# Altium schematic sheet CarWire.SchDoc
size 800 x 800 mm; SheetNumber: 1; SheetTotal: 2
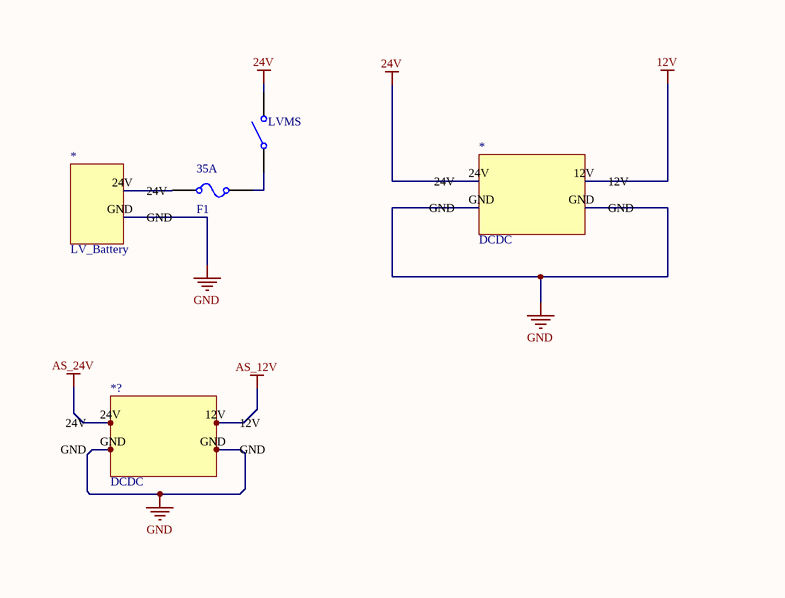
[diagram p0: CarWire.SchDoc, top left]
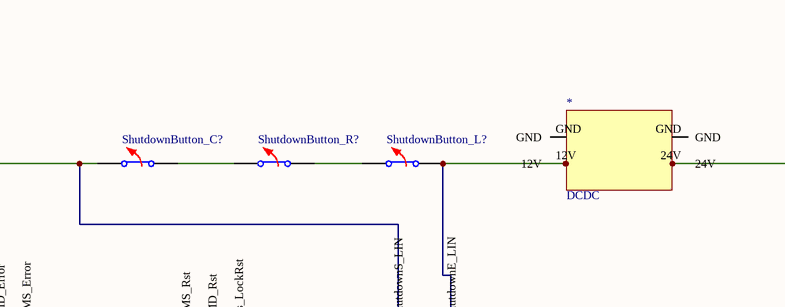
[diagram p1: CarWire.SchDoc, top right]
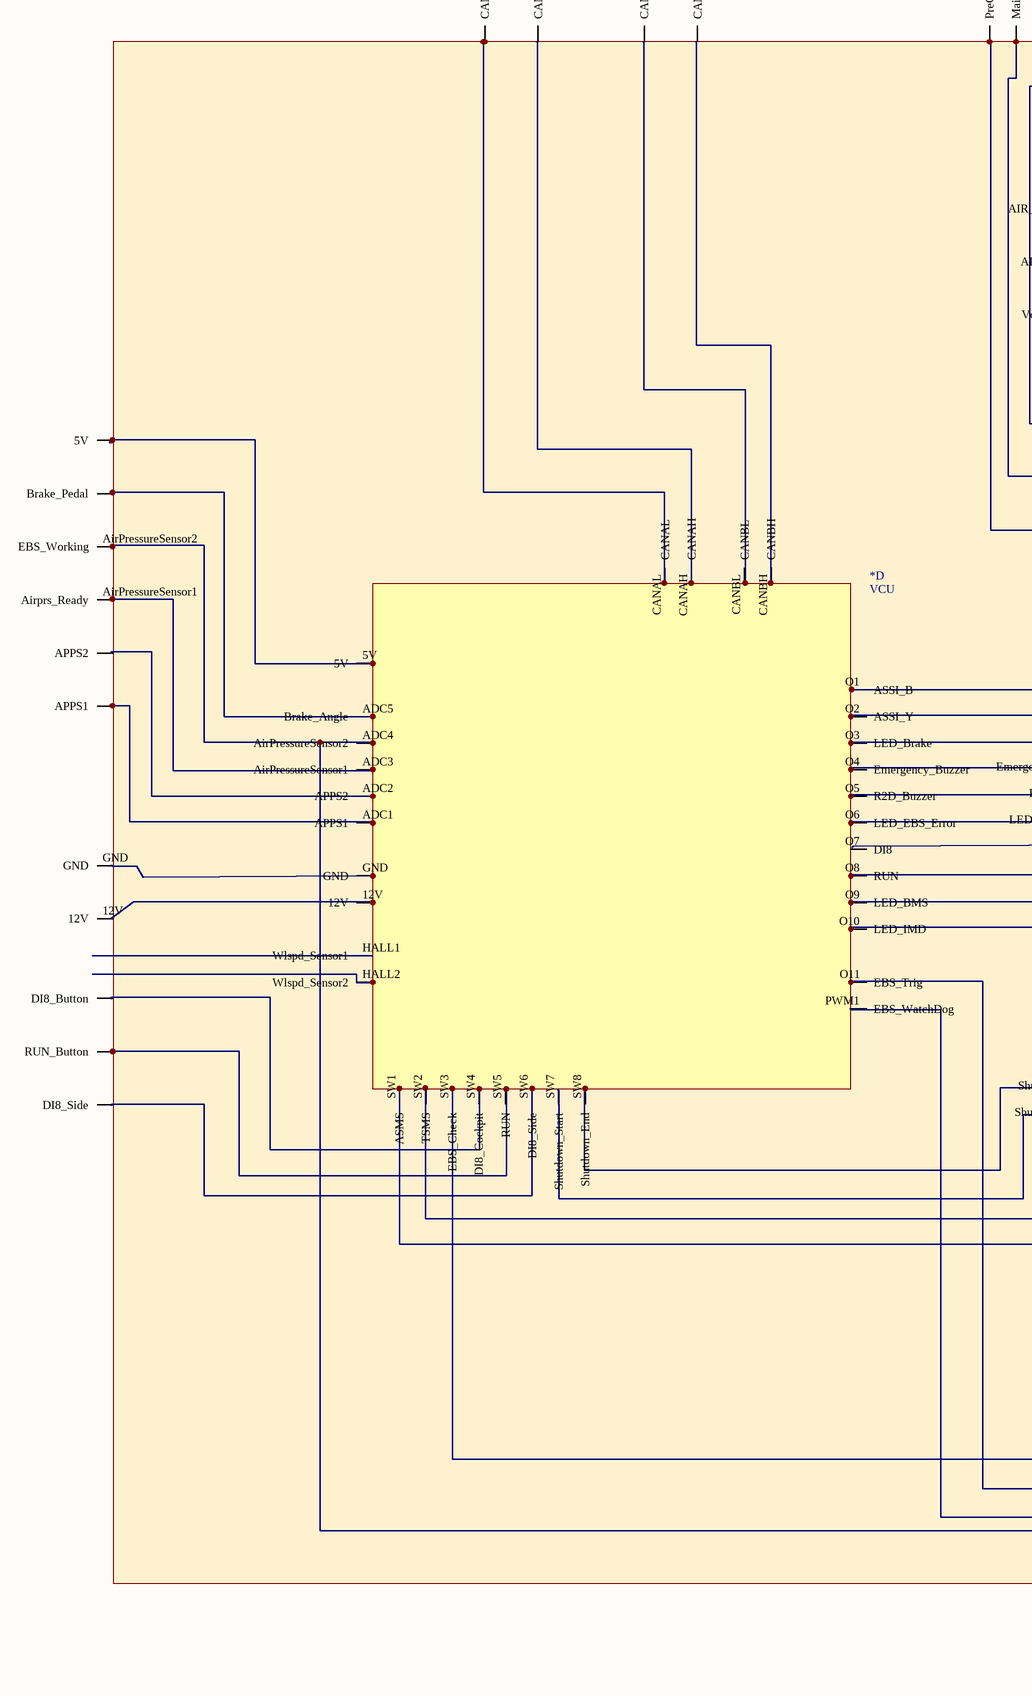
[diagram p2: CarWire.SchDoc, bottom left]
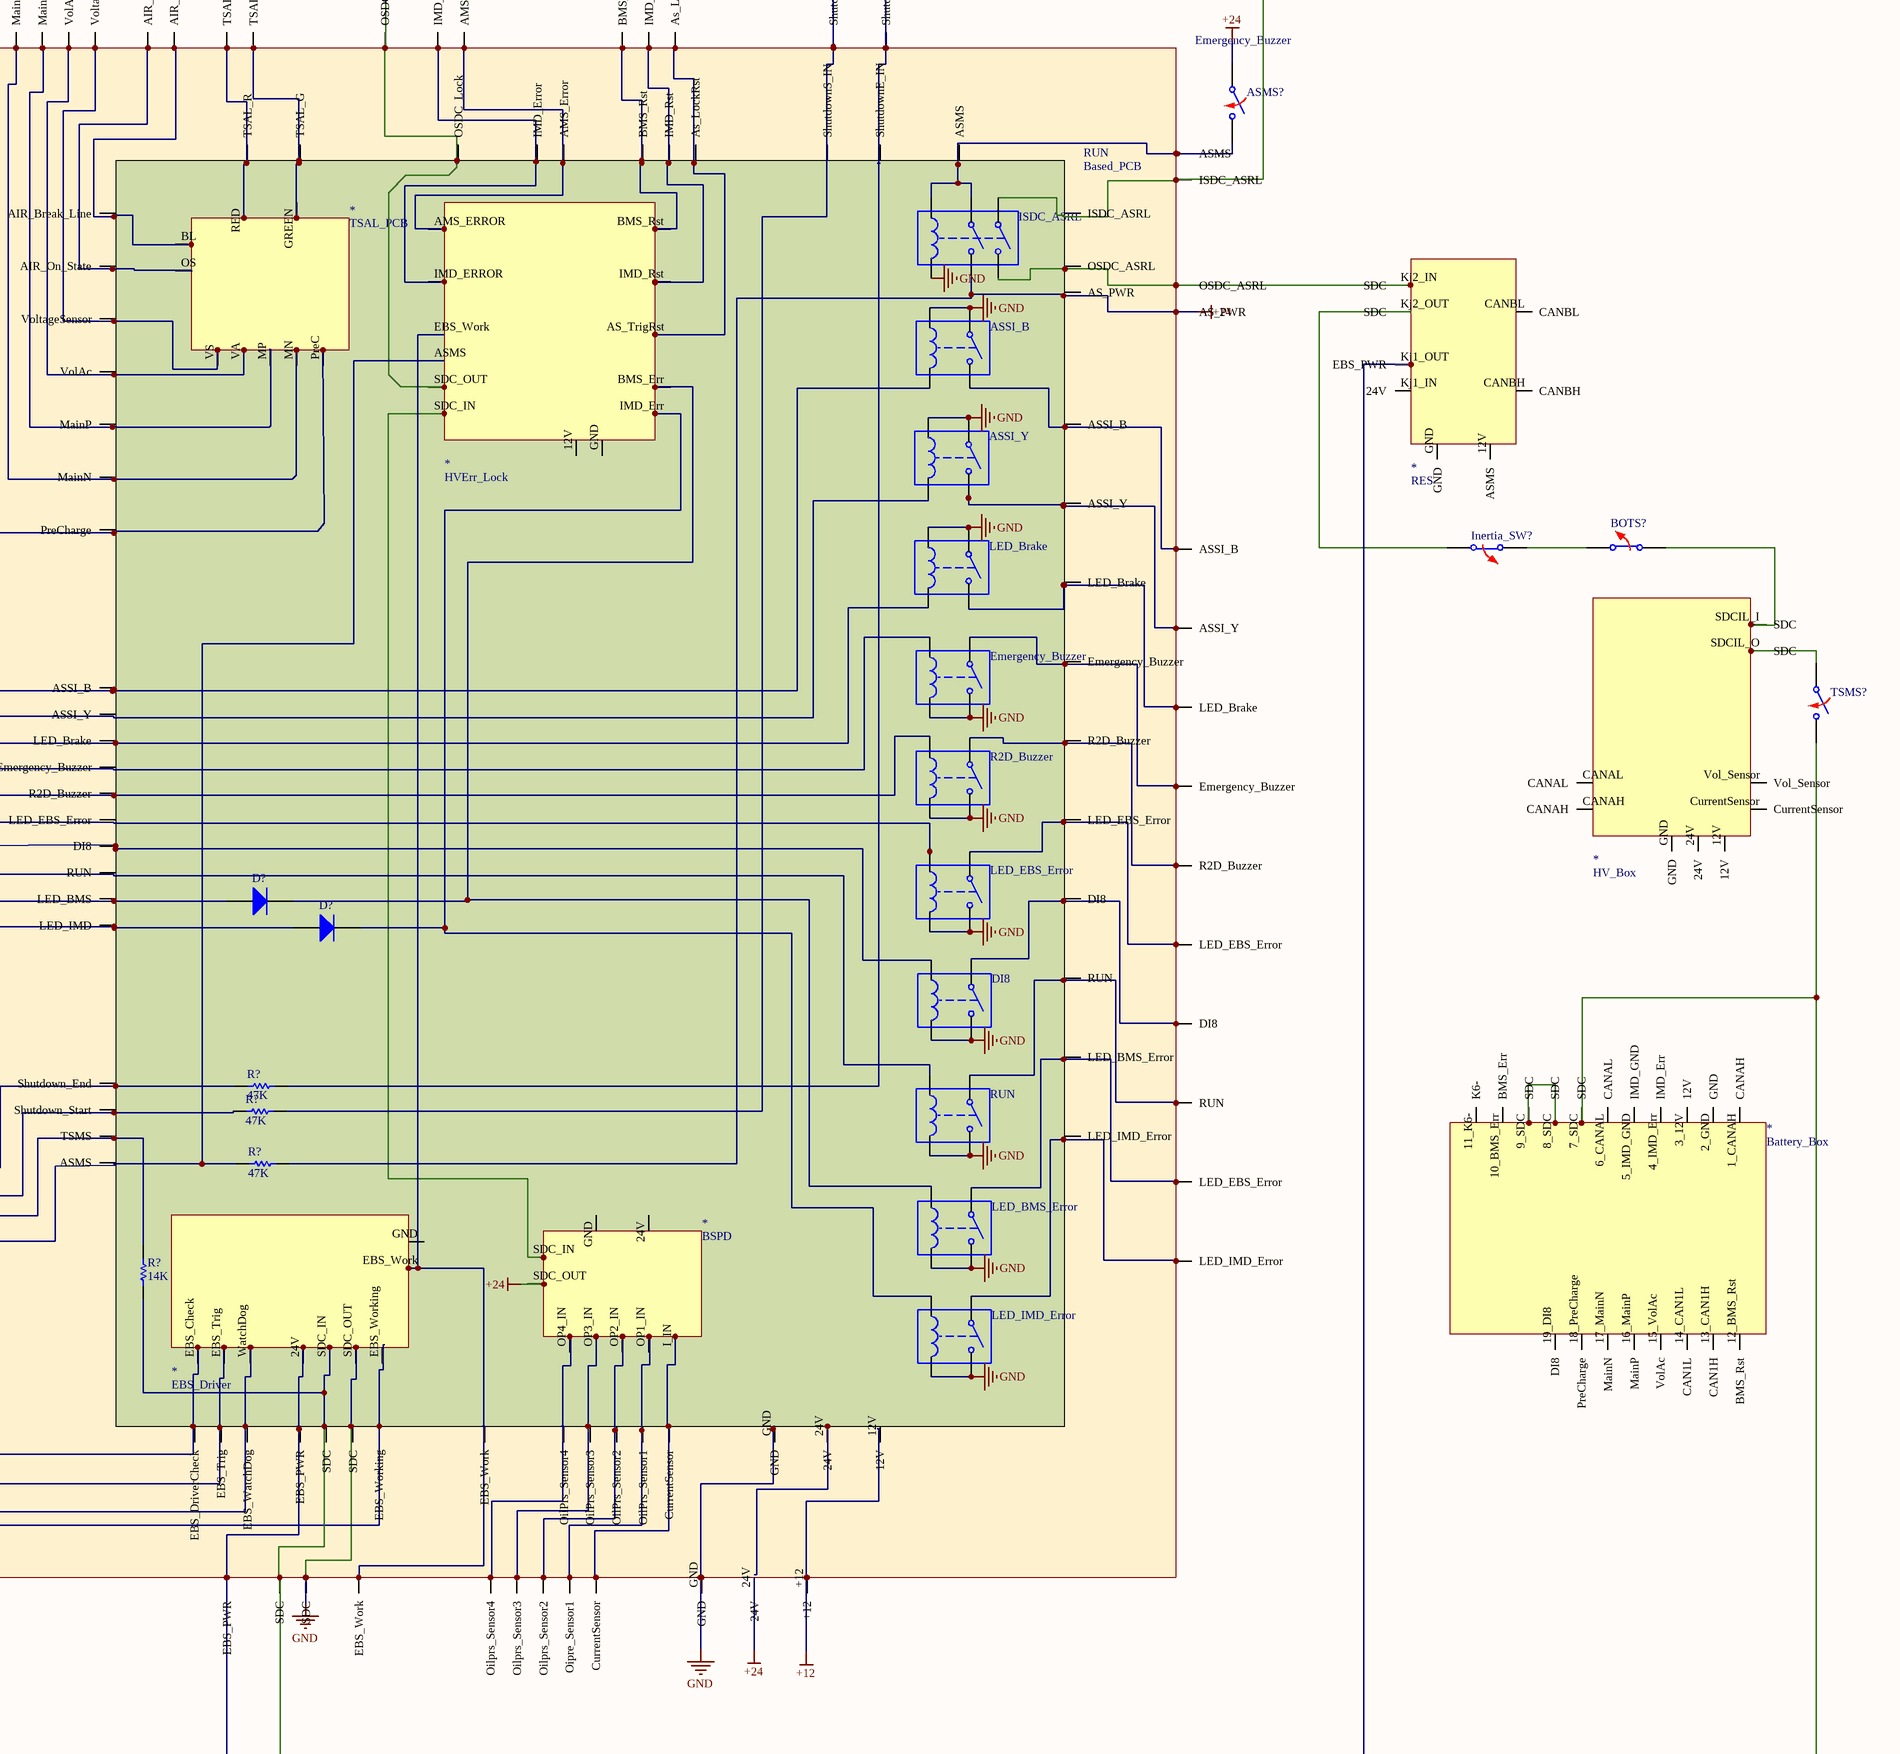
[diagram p3: CarWire.SchDoc, bottom right]

## Parts
(Parts that share a designator on the sheet are numbered #1, #2 ... from top to bottom, then left to right.)
35A  F1
*#1  DCDC
*#2  LV_Battery
*#3  DCDC
*#4  RES
*#5  TSAL_PCB
*#6  HVErr_Lock
*#7  HV_Box
*#8  VCU  (part D of 4)
*#9  Battery_Box
*#10  BSPD
*#11  EBS_Driver
*?  DCDC
ASMS?  Switch Normally Opened  (value not drawn)
ASSI_B  Single-Pole, Single-Throw Normally Opened Relay  (value not drawn)
ASSI_Y  Single-Pole, Single-Throw Normally Opened Relay  (value not drawn)
BOTS?  Switch Normally Closed  (value not drawn)
D?#1  Diode  (value not drawn)
D?#2  Diode  (value not drawn)
DI8  Single-Pole, Single-Throw Normally Opened Relay  (value not drawn)
Emergency_Buzzer#1  Single-Pole, Single-Throw Normally Opened Relay  (value not drawn)
Emergency_Buzzer#2  (no value)
Inertia_SW?  Switch Normally Closed  (value not drawn)
ISDC_ASRL  Double-Pole, Single-Throw Relay  (value not drawn)
LED_BMS_Error  Single-Pole, Single-Throw Normally Opened Relay  (value not drawn)
LED_Brake  Single-Pole, Single-Throw Normally Opened Relay  (value not drawn)
LED_EBS_Error  Single-Pole, Single-Throw Normally Opened Relay  (value not drawn)
LED_IMD_Error  Single-Pole, Single-Throw Normally Opened Relay  (value not drawn)
LVMS  Single-Pole, Single-Throw Switch  (value not drawn)
R2D_Buzzer  Single-Pole, Single-Throw Normally Opened Relay  (value not drawn)
R?#1  value 47K  (hidden comment: Resistor)
R?#2  value 47K  (hidden comment: Resistor)
R?#3  value 47K  (hidden comment: Resistor)
R?#4  value 14K  (hidden comment: Resistor)
RUN#1  Single-Pole, Single-Throw Normally Opened Relay  (value not drawn)
RUN#2  Based_PCB
ShutdownButton_C?  Switch Normally Closed  (value not drawn)
ShutdownButton_L?  Switch Normally Closed  (value not drawn)
ShutdownButton_R?  Switch Normally Closed  (value not drawn)
TSMS?  Switch Normally Opened  (value not drawn)

## Nets
12V: *#1.12V
24V: *#1.24V LVMS.2
+12: Emergency_Buzzer#2.+12
+24: *#10.SDC_OUT ASMS?.1 Emergency_Buzzer#2.24V Emergency_Buzzer#2.?27(AS_PWR) ISDC_ASRL.4 R?#3.2
AS_12V: *?.12V
AS_24V: *?.24V
GND: *#1.GND *#2.GND *#11.SDC_OUT *?.GND ASSI_B.1 ASSI_B.3 ASSI_Y.1 ASSI_Y.3 DI8.2 DI8.4 Emergency_Buzzer#1.2 Emergency_Buzzer#1.4 Emergency_Buzzer#2.?37(SDC) Emergency_Buzzer#2.GND ISDC_ASRL.6 LED_BMS_Error.2 LED_BMS_Error.4 LED_Brake.1 LED_Brake.3 LED_EBS_Error.2 LED_EBS_Error.4 LED_IMD_Error.2 LED_IMD_Error.4 R2D_Buzzer.2 R2D_Buzzer.4 RUN#1.2 RUN#1.4 RUN#2.?2(SDC) RUN#2.GND
Net35A_1: 35A.1 *#2.24V
Net35A_2: 35A.2 LVMS.1
Net*#3_12V: *#3.12V Emergency_Buzzer#2.?49(ShutdownE_LIN) R?#1.2 ShutdownButton_L?.2
Net*#3_24V: *#3.24V Emergency_Buzzer#2.?25(ISDC_ASRL) ISDC_ASRL.1
Net*#4_Kj1_OUT: *#4.Kj1_OUT(EBS_PWR) *#11.24V Emergency_Buzzer#2.?36(EBS_PWR)
Net*#4_Kj2_IN: *#4.Kj2_IN(SDC) Emergency_Buzzer#2.?26(OSDC_ASRL) ISDC_ASRL.2
Net*#4_Kj2_OUT: *#4.Kj2_OUT(SDC) Inertia_SW?.2
Net*#5_BL: *#5.BL Emergency_Buzzer#2.?16(AIR_Break_Line)
Net*#5_GREEN: *#5.GREEN Emergency_Buzzer#2.?18(TSAL_G) RUN#2.?27(TSAL_G)
Net*#5_MN: *#5.MN Emergency_Buzzer#2.?11(MainN)
Net*#5_MP: *#5.MP Emergency_Buzzer#2.?12(MainP)
Net*#5_OS: *#5.OS Emergency_Buzzer#2.?15(AIR_On_State)
Net*#5_PreC: *#5.PreC Emergency_Buzzer#2.?10(PreCharge)
Net*#5_RED: *#5.RED Emergency_Buzzer#2.?17(TSAL_R)
Net*#5_VA: *#5.VA Emergency_Buzzer#2.?13(VolAc)
Net*#5_VS: *#5.VS Emergency_Buzzer#2.?14(VoltageSensor)
Net*#6_AMS_ERROR: *#6.AMS_ERROR Emergency_Buzzer#2.?20(AMS_Error)
Net*#6_AS_TrigRst: *#6.AS_TrigRst Emergency_Buzzer#2.?22(As_LockRst)
Net*#6_ASMS: *#6.ASMS *#8.SW1(ASMS) R?#3.1
Net*#6_BMS_Err: *#6.BMS_Err D?#1.2(K) LED_BMS_Error.3
Net*#6_BMS_Rst: *#6.BMS_Rst Emergency_Buzzer#2.?23(BMS_Rst) RUN#2.?32(BMS_Rst)
Net*#6_EBS_Work: *#6.EBS_Work *#11.EBS_Work Emergency_Buzzer#2.?39(EBS_Work)
Net*#6_IMD_Err: *#6.IMD_Err D?#2.2(K) LED_IMD_Error.3
Net*#6_IMD_ERROR: *#6.IMD_ERROR Emergency_Buzzer#2.?21(IMD_Error)
Net*#6_IMD_Rst: *#6.IMD_Rst Emergency_Buzzer#2.?44(IMD_Rst)
Net*#6_SDC_IN: *#6.SDC_IN *#10.SDC_IN
Net*#6_SDC_OUT: *#6.SDC_OUT Emergency_Buzzer#2.?19(OSDC_Lock) Emergency_Buzzer#2.?48(ShutdownS_LIN) R?#2.2 RUN#2.?30(OSDC_Lock) ShutdownButton_C?.1
Net*#7_SDCIL_I: *#7.SDCIL_I(SDC) BOTS?.2
Net*#7_SDCIL_O: *#7.SDCIL_O(SDC) TSMS?.1
Net*#8_ADC1: *#8.ADC1(APPS1) Emergency_Buzzer#2.?3(APPS1)
Net*#8_ADC4: *#8.ADC4(AirPressureSensor2) RUN#2.?6(EBS_Working)
Net*#8_O1: *#8.O1(ASSI_B) ASSI_B.4 RUN#2.?18(ASSI_B)
Net*#8_O2: *#8.O2(ASSI_Y) ASSI_Y.4
Net*#8_O3: *#8.O3(LED_Brake) LED_Brake.4
Net*#8_O4: *#8.O4(Emergency_Buzzer) Emergency_Buzzer#1.3
Net*#8_O5: *#8.O5(R2D_Buzzer) R2D_Buzzer.3
Net*#8_O6: *#8.O6(LED_EBS_Error) LED_EBS_Error.3
Net*#8_O8: *#8.O8(RUN) RUN#1.3
Net*#8_O9: *#8.O9(LED_BMS) D?#1.1(A)
Net*#8_O10: *#8.O10(LED_IMD) D?#2.1(A) RUN#2.?57(LED_IMD)
Net*#8_O11: *#8.O11(EBS_Trig) *#11.EBS_Trig
Net*#8_PWM1: *#8.PWM1(EBS_WatchDog) *#11.WatchDog RUN#2.?5(EBS_WatchDog)
Net*#8_SW2: *#8.SW2(TSMS) R?#4.2
Net*#8_SW3: *#8.SW3(EBS_Check) *#11.EBS_Check RUN#2.?3(EBS_DriverCheck)
Net*#8_SW8: *#8.SW8(Shutdown_End) R?#1.1 RUN#2.?53(Shutdown_End)
Net*#9_7_SDC: *#9.7_SDC(SDC) *#11.SDC_IN Emergency_Buzzer#2.?38(SDC) R?#4.1 RUN#2.?1(SDC) TSMS?.2
Net*#9_8_SDC: *#9.8_SDC(SDC) *#9.9_SDC(SDC)
Net*#10_I_IN: *#10.I_IN Emergency_Buzzer#2.?42(CurrentSensor) RUN#2.?8(CurrentSensor)
Net*#10_OP1_IN: *#10.OP1_IN Emergency_Buzzer#2.?41(Oipre_Sensor1)
Net*#10_OP2_IN: *#10.OP2_IN Emergency_Buzzer#2.?46(Oilprs_Sensor2)
Net*#10_OP3_IN: *#10.OP3_IN Emergency_Buzzer#2.?40(Oilprs_Sensor3) RUN#2.?48(OilPrs_Sensor3)
Net*#10_OP4_IN: *#10.OP4_IN Emergency_Buzzer#2.?47(Oilprs_Sensor4)
NetASMS?_2: ASMS?.2 Emergency_Buzzer#2.?24(ASMS) ISDC_ASRL.3 ISDC_ASRL.5
NetASSI_B_2: ASSI_B.2 Emergency_Buzzer#2.?28(ASSI_B)
NetASSI_Y_2: ASSI_Y.2 Emergency_Buzzer#2.?29(ASSI_Y) RUN#2.?38(ASSI_Y)
NetBOTS?_1: BOTS?.1 Inertia_SW?.1
NetDI8_1: DI8.1 Emergency_Buzzer#2.?34(DI8)
NetDI8_3: DI8.3 RUN#2.?24(DI8)
NetEmergency_Buzzer#1_1: Emergency_Buzzer#1.1 Emergency_Buzzer#2.?31(Emergency_Buzzer)
NetEmergency_Buzzer#2_?30: Emergency_Buzzer#2.?30(LED_Brake) LED_Brake.2 RUN#2.?39(LED_Brake)
NetEmergency_Buzzer#2_?32: Emergency_Buzzer#2.?32(R2D_Buzzer) R2D_Buzzer.1
NetEmergency_Buzzer#2_?33: Emergency_Buzzer#2.?33(LED_EBS_Error) LED_EBS_Error.1
NetEmergency_Buzzer#2_?35: Emergency_Buzzer#2.?35(RUN) RUN#1.1
NetEmergency_Buzzer#2_?50: Emergency_Buzzer#2.?50(LED_EBS_Error) LED_BMS_Error.1
NetEmergency_Buzzer#2_?51: Emergency_Buzzer#2.?51(LED_IMD_Error) LED_IMD_Error.1
NetShutdownButton_C?_2: ShutdownButton_C?.2 ShutdownButton_R?.1
NetShutdownButton_L?_1: ShutdownButton_L?.1 ShutdownButton_R?.2

Not connected (* = marked no-connect by the designer): *#3 GND; *#4 12V(ASMS) CANBH CANBL GND Kj1_IN(24V); *#6 12V GND; *#7 12V 24V CANAH CANAL CurrentSensor GND Vol_Sensor; *#8 5V 12V ADC2(APPS2) ADC3(AirPressureSensor1) ADC5(Brake_Angle) CANAH CANAL CANBH CANBL GND HALL1(Wlspd_Sensor1) HALL2(Wlspd_Sensor2) O7(DI8) SW4(DI8_Cockpit) SW5(RUN) SW6(DI8_Side) SW7(Shutdown_Start); *#9 1_CANAH(CANAH) 2_GND(GND) 3_12V(12V) 4_IMD_Err(IMD_Err) 5_IMD_GND(IMD_GND) 6_CANAL(CANAL) 10_BMS_Err(BMS_Err) 11_K6-(K6-) 12_BMS_Rst(BMS_Rst) 13_CAN1H(CAN1H) 14_CAN1L(CAN1L) 15_VolAc(VolAc) 16_MainP(MainP) 17_MainN(MainN) 18_PreCharge(PreCharge) 19_DI8(DI8); *#10 24V GND; *#11 EBS_Working GND; Emergency_Buzzer#2 12V ?1(Brake_Pedal) ?2(APPS2) ?4(DI8_Button) ?5(RUN_Button) ?6(CANAL) ?7(CANAH) ?8(CANBL) ?9(CANBH) ?43(5V) ?45(DI8_Side) AirPressureSensor1(Airprs_Ready) AirPressureSensor2(EBS_Working); R?#2 1; RUN#2 12V 24V ?4(EBS_Trig) ?7(EBS_Work) ?9(OilPrs_Sensor1) ?10(OilPrs_Sensor2) ?11(AIR_Break_Line) ?12(AIR_On_State) ?13(VoltageSensor) ?14(VolAc) ?15(MainP) ?16(MainN) ?17(PreCharge) ?19(ASSI_Y) ?20(LED_Brake) ?21(Emergency_Buzzer) ?22(R2D_Buzzer) ?23(LED_EBS_Error) ?25(RUN) ?26(TSAL_R) ?28(IMD_Error) ?29(AMS_Error) ?31(IMD_Rst) ?33(ASMS) ?34(AS_PWR) ?35(ISDC_ASRL) ?36(OSDC_ASRL) ?37(ASSI_B) ?40(Emergency_Buzzer) ?41(R2D_Buzzer) ?42(LED_EBS_Error) ?43(DI8) ?44(RUN) ?45(EBS_PWR) ?46(ASMS) ?47(TSMS) ?49(OilPrs_Sensor4) ?50(ShutdownS_IN) ?51(ShutdownE_IN) ?52(Shutdown_Start) ?54(LED_BMS_Error) ?55(LED_IMD_Error) ?56(LED_BMS) ?58(As_LockRst)

## Library data of the parts
35A = Fuse: RESISTANCE: 1m; SimulationGenericComponent: True; CURRENT: F1
ASMS? TSMS? = SW NO: closed: 0; Rclosed: 1m; Ropen: 1Meg; SimulationGenericComponent: True
ASSI_B ASSI_Y DI8 Emergency_Buzzer#1 LED_BMS_Error LED_Brake LED_EBS_Error LED_IMD_Error R2D_Buzzer RUN#1 = SPST Relay NO: L_C: 1u; R_C: 100; RON: 1; ROFF: 1e12; ION: 1m; IOFF: 0; SimulationGenericComponent: True
BOTS? Inertia_SW? ShutdownButton_C? ShutdownButton_L? ShutdownButton_R? = SW NC: closed: 1; Rclosed: 1m; Ropen: 1Meg; SimulationGenericComponent: True
D?#1 D?#2 = Diode: AF: 1; BV: 0; BV_MAX: 1e99; EG: 1.11; FC: 0.5; IBV: 0.001; ISR: 1e-14; MJSW: 0.33; NTUN: 30; TNOM: 27; XTI: 3; SimulationGenericComponent: True; CJO: 0; CJP: 0; CTA: 0; CTP: 0; FCS: 0.5; FV_MAX: 1e99; IKF: 0; IKR: 0; JSW: 0; JTUN: 0; JTUNSW: 0; KEG: 1; KF: 0; LEVEL: 1; N: 1; NBV: 1; NR: 1; NS: 1; PHP: 1; RS: 0; TCV: 0; TLEV: 0; TLEVC: 0; TM1: 0; TM2: 0; TPB: 0; TPHP: 0; TRS: 0; TRS2: 0; TT: 0; TTT1: 0; TTT2: 0; VJ: 1; XTITUN: 3; IS: 1e-14
Emergency_Buzzer#2 = Low_Vol_Box_New
ISDC_ASRL = DPST Relay: L_C: 1u; R_C: 100; RON: 1; ROFF: 1e12; ION: 1m; IOFF: 0; SimulationGenericComponent: True
LVMS = SPST SW: closed: 0; Rclosed: 1m; Ropen: 1Meg; SimulationGenericComponent: True
R?#1-R?#4 = Resistor: TC1: 0; SimulationGenericComponent: True; TC2: 0